# Altium project B100AA Development Kit.PrjPcb (part 5 of 5)

## Sheet Sleep Timer.SchDoc: Sleep Timer
size A3; ApprovedBy: Mehmet Günce Akkoyun; CheckedBy: Mehmet Günce Akkoyun; Author: Mehmet Günce Akkoyun; CompanyName: Ovoo Electronics; DrawnBy: Mehmet Günce Akkoyun; Engineer: Mehmet Günce Akkoyun; Organization: Ovoo Electronics; Address1: Necip Fazýl Mah. Ortaýrmak Sok.; Address2: Birgül Apt. No: 19/6; Address3: Meram / Konya; Address4: Turkiye; DocumentNumber: AA001; Revision: B100AA Dev Kit
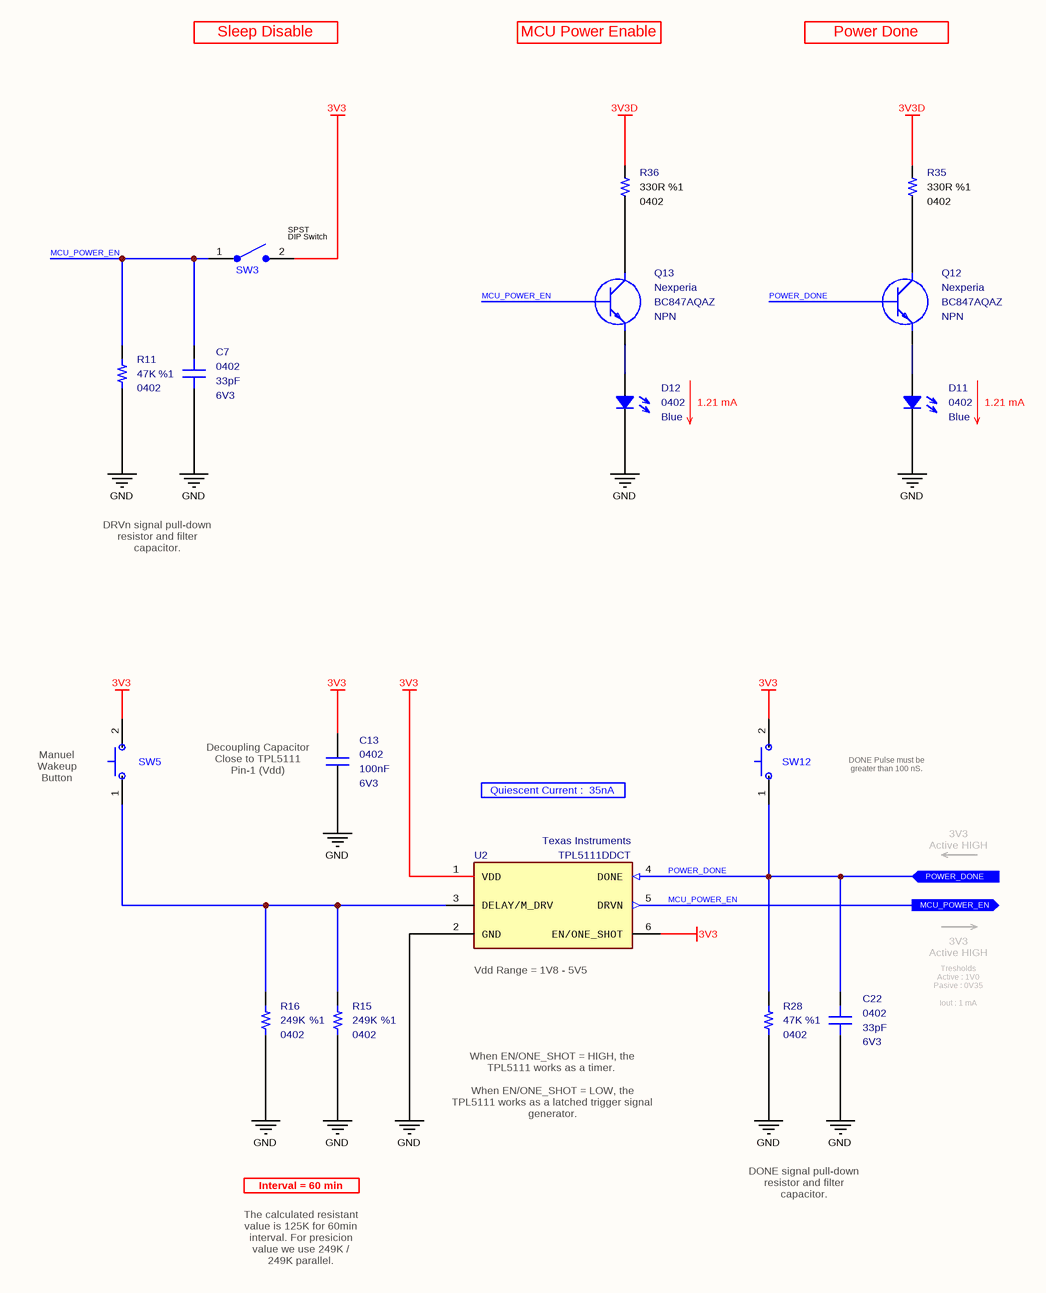
[diagram p36: Sleep Timer.SchDoc]

### Parts
C7  value 33pF  Case: 0402  Voltage: 6V3  [CAPACITOR_0402]  (hidden comment: Multilayer Ceramic Capacitor)
C13  value 100nF  Case: 0402  Voltage: 6V3  [CAPACITOR_0402]  (hidden comment: Multilayer Ceramic Capacitor)
C22  value 33pF  Case: 0402  Voltage: 6V3  [CAPACITOR_0402]  (hidden comment: Multilayer Ceramic Capacitor)
D11  Case: 0402  Color: Blue  [LED_0402]  (hidden comment: SMD LED (Blue))
D12  Case: 0402  Color: Blue  [LED_0402]  (hidden comment: SMD LED (Blue))
Q12  Manufacturer_Name: Nexperia  Manufacturer_Part_Number: BC847AQAZ  Polarity: NPN  [SOT1215]  (hidden comment: Bipolar NPN Transistors)
Q13  Manufacturer_Name: Nexperia  Manufacturer_Part_Number: BC847AQAZ  Polarity: NPN  [SOT1215]  (hidden comment: Bipolar NPN Transistors)
R11  value 47K  Tolerance: %1  Case: 0402  [RESISTOR_0402]  (hidden comment: Thick Film Resistor)
R15  value 249K  Tolerance: %1  Case: 0402  [RESISTOR_0402]  (hidden comment: Thick Film Resistor)
R16  value 249K  Tolerance: %1  Case: 0402  [RESISTOR_0402]  (hidden comment: Thick Film Resistor)
R28  value 47K  Tolerance: %1  Case: 0402  [RESISTOR_0402]  (hidden comment: Thick Film Resistor)
R35  value 330R  Tolerance: %1  Case: 0402  [RESISTOR_0402]  (hidden comment: Thick Film Resistor)
R36  value 330R  Tolerance: %1  Case: 0402  [RESISTOR_0402]  (hidden comment: Thick Film Resistor)
SW3  DIP Switch  [DS04-254-2-01BK-SMT-TR]  (value not drawn)
SW5  Tactile Switches  [PTS526_Switch]  (value not drawn)
SW12  Tactile Switches  [PTS526_Switch]  (value not drawn)
U2  Manufacturer _Part_Number: TPL5111DDCT  Manufacturer_Name: Texas Instruments  [SOT-23-6]  (hidden comment: Nanopower Timer IC)

### Ports
MCU_POWER_EN (out), POWER_DONE (in)

### Nets
3V3: C13.2 SW3.2(NO) SW5.2(COM) SW12.2(COM) U2.1(VDD) U2.6(EN/ONE_SHOT)
3V3D: R35.2 R36.2
GND: C7.1 C13.1 C22.1 D11.1 D12.1 R11.1 R15.1 R16.1 R28.1 U2.2(GND)
MCU_POWER_EN: C7.2 Q13.1(B) R11.2 SW3.1(COM) U2.5(DRVN) ; port MCU_POWER_EN
POWER_DONE: C22.2 Q12.1(B) R28.2 SW12.1(NC) U2.4(DONE) ; port POWER_DONE
NetD11_2: D11.2 Q12.2(E)
NetD12_2: D12.2 Q13.2(E)
NetQ12_3: Q12.3(C) R35.1
NetQ13_3: Q13.3(C) R36.1
NetR15_2: R15.2 R16.2 SW5.1(NC) U2.3(DELAY/M_DRV)

### Notes on the sheet
- Sleep Disable
- MCU Power Enable
- Power Done
- 1.21 mA
- DRVn signal pull-down resistor and filter capacitor.
- (near SW5) Manuel Wakeup Button
- (near C13) Decoupling Capacitor
  Close to TPL5111
  Pin-1 (Vdd)
- DONE Pulse must be greater than 100 nS.
- Quiescent Current :  35nA
- 3V3
  Active HIGH
- (near U2) Vdd Range = 1V8 - 5V5
- Tresholds
  Active : 1V0
  Pasive : 0V35
  Iout : 1 mA
- When EN/ONE_SHOT = HIGH, the TPL5111 works as a timer.
  When EN/ONE_SHOT = LOW, the TPL5111 works as a latched trigger signal generator.
- Interval = 60 min
- DONE signal pull-down resistor and filter capacitor.
- The calculated resistant value is 125K for 60min interval. For presicion value we use 249K / 249K parallel.
- Title
- Size:
- Date:
- A3
- Number:
- Time:
- Revision:
- Sheet
- of
- File:
- (in symbol Switch - DIP Switch (1 Pole)) SPST

### Library data of the parts
C7 C22 = Capacitor - 33pF [0402-6V3]: Capacitor - 33pF [0402] (Ceramic); Manufacturer_Name: Kemet; Manufacturer_Part_Number: C0402C330J9RACAUTO; Dielectric: X7R; Tolerance: 10%; Height: 0.5mm; Mouser_Part_Number: 80-C0402C330J9RAUTO; Maximum Operating Temperature: +125; Minimum Operating Temperature: -55; ROHS: Yes; ComponentLink1Description: DataSheet; ComponentLink1URL: https://api.kemet.com/component-edge/download/datasheet/C0402C330J9RACAUTO.pdf; ComponentLink2Description: Mouser; ComponentLink2URL: https://www.mouser.com/Search/Refine.aspx?Keyword=80-C0402C330J9RAUTO; Supplier 1: Mouser; Supplier Part Number 1: 80-C0402C330J9RAUTO
C13 = Capacitor - 100nF [0402-6V3]: Capacitor - 100nF [0402-6V3] (Ceramic); Manufacturer_Name: AVX; Manufacturer_Part_Number: 04026D104KAT4A; Dielectric: X5R; Tolerance: %10; Height: 0.25mm; Mouser_Part_Number: 581-04026D104KAT4A; ComponentLink1Description: Mouser; ComponentLink1URL: https://www.mouser.com.tr/ProductDetail/AVX/04026D104KAT4A?qs=sGAEpiMZZMs0AnBnWHyRQPg4iYkCw7IMED%2F4kpqgf7w%3D; ComponentLink2Description: DataSheet; ComponentLink2URL: https://www.mouser.com.tr/datasheet/2/40/cx5r-776519.pdf; ROHS: Yes; Maximum Operating Temperature: +85; Minimum Operating Temperature: -55; Supplier 1: Avnet; Supplier Part Number 1: 04026D104KAT4A
D11 D12 = Diode - LED (0402-Blue): as D53-D55 on sheet GSM Control Signals; Mouser_Part_Number: 755-SMLP13BC8TT86; ROHS: Yes; ComponentLink1Description: DataSheet; ComponentLink1URL: https://d1d2qsbl8m0m72.cloudfront.net/en/products/databook/datasheet/opto/led/chip_mono/sml-p1-e.pdf; ComponentLink2Description: Mouser; ComponentLink2URL: https://www.mouser.com.tr/ProductDetail/ROHM-Semiconductor/SMLP13BC8TT86?qs=%2Fha2pyFaduidYDgXFKL%252BNZwCVZNUI4FlyPWWbVDx1b6ABmzS%252BS2f0w%3D%3D; Supplier 1: Mouser; Supplier 2: Digi-Key; Supplier Part Number 1: 755-SMLP13BC8TT86; Supplier Part Number 2: 846-1112-1-ND
Q12 Q13 = Transistor - BC847: as Q50-Q52 on sheet GSM Control Signals; Mouser_Part_Number: 771-BC847AQAZ; ComponentLink1Description: DataSheet; ComponentLink1URL: https://www.mouser.com.tr/datasheet/2/916/BC847XQA_SER-1598405.pdf; ComponentLink2Description: Mouser; ComponentLink2URL: https://www.mouser.com.tr/ProductDetail/Nexperia/BC847AQAZ?qs=%2Fha2pyFaduhKMCPKNtQimeJpXTw9z4AqURd2YARs8DVICZNv3AT9Dw%3D%3D; Case: DFN-1010D-3; Supplier 1: Mouser; Supplier 2: Digi-Key; Supplier Part Number 1: 771-BC847AQAZ; Supplier Part Number 2: 1727-2545-1-ND
R11 R28 = Resistor - 47K: Thick Film Resistors - SMD 1/16 W 47 Kohms 1%; Manufacturer_Name: Vishay; Manufacturer_Part_Number: CRCW040247K0FKED; Height: 0.4mm; Mouser_Part_Number: 71-CRCW0402-47K-E3; ComponentLink1Description: DataSheet; ComponentLink1URL: https://www.mouser.com.tr/datasheet/2/427/dcrcwe3-1762152.pdf; ComponentLink2Description: Mouser; ComponentLink2URL: https://www.mouser.com.tr/ProductDetail/Vishay-Dale/CRCW040247K0FKED?qs=sGAEpiMZZMu61qfTUdNhG2DpbjADlD3GL%252B3h1elTxqU%3D; Supplier 1: Mouser; Supplier 2: Digi-Key; Supplier Part Number 1: 71-CRCW040247K0FKEDH; Supplier Part Number 2: 541-47.0KYCT-ND
R15 R16 = Resistor - 249K: Thick Film Resistors - SMD 1/16 W 249 Kohms 1%; Manufacturer_Name: Vishay; Manufacturer_Part_Number: CRCW0402249KFKED; Height: 0.35mm; Mouser_Part_Number: 71-CRCW0402-249K-E3; ComponentLink1Description: DataSheet; ComponentLink1URL: https://www.mouser.com.tr/datasheet/2/427/dcrcwe3-1762152.pdf; ComponentLink2Description: Mouser; ComponentLink2URL: https://www.mouser.com.tr/ProductDetail/Vishay-Dale/CRCW0402249KFKED?qs=sGAEpiMZZMu61qfTUdNhG2DpbjADlD3GEiYBObatoAI%3D; Supplier 1: Mouser; Supplier 2: Digi-Key; Supplier Part Number 1: 71-CRCW0402-249K-E3; Supplier Part Number 2: 541-249KLCT-ND
R35 R36 = Resistor - 330R: as R120-R122 on sheet GSM Control Signals; Height: 0.4mm; ComponentLink1Description: DataSheet; ComponentLink1URL: https://www.mouser.com.tr/datasheet/2/427/dcrcwe3-1762152.pdf; ComponentLink2Description: Mouser; ComponentLink2URL: https://www.mouser.com.tr/ProductDetail/Vishay-Dale/CRCW0402330RFKED?qs=sGAEpiMZZMu61qfTUdNhG2DpbjADlD3GGS6SwBlLi5Q%3D; Supplier 1: Mouser; Supplier 2: Digi-Key; Supplier Part Number 2: 541-330LCT-ND; Supplier Part Number 1: 71-CRCW0402-330-E3; Mouser Part Number: 71-CRCW0402-330-E3
SW3 = Switch - DIP Switch (1 Pole): DIP Switches/SIP Switches DIP Switch, SPST, 2.54 pitch, flat actuator, SMT, Tape and reel, 1 position, Black; Manufacturer Name: CUI Devices; Manufacturer Part Number: DS04-254-2-01BK-SMT-TR; Mouser Part Number: 490-DS04254201BK-STR; ComponentLink1Description: DataSheet; ComponentLink1URL: https://www.mouser.com.tr/datasheet/2/670/ds04_254_smt-1777718.pdf; ComponentLink2Description: Mouser; ComponentLink2URL: https://www.mouser.com.tr/ProductDetail/CUI-Devices/DS04-254-2-01BK-SMT-TR/?qs=%2Fha2pyFadujy0kBXqTx%252B7K4ZqypoI1xcyUu3ptD5LL%252BAwZdjUHFG%252BXP1ryAUxmHU; Supplier 1: RSComponents; Supplier 2: Arrow Electronics; Supplier 3: Farnell; Supplier 4: Newark; Supplier 5: Digi-Key; Supplier Part Number 1: 6820986; Supplier Part Number 2: A6S-1104-H; Supplier Part Number 3: 1960892; Supplier Part Number 4: 83T2298; Supplier Part Number 5: Z5187-ND
SW5 SW12 = Switch - Tactile: Tactile Switches 50mA 12VDC, 5.2x5.2mm, 0.8mm H, 260gf, G leads.; Manufacturer Name: C&K Switches; Manufacturer Part Number: PTS526 SK08 SMTR2 LFS; Height: 0.8mm; Mouser Part Number: 611-PTS526SK08SMTR2L; ComponentLink1Description: DataSheet; ComponentLink1URL: https://eu.mouser.com/datasheet/2/60/pts526-1651200.pdf; ComponentLink2Description: Mouser; ComponentLink2URL: https://eu.mouser.com/ProductDetail/CK/PTS526-SK08-SMTR2-LFS?qs=sGAEpiMZZMsgGjVA3toVBL%2FRce%252ByN3s1hQPqiLlQ%252BeM%3D; Supplier 1: Future Electronics; Supplier 2: Mouser; Supplier 3: Arrow; Supplier 4: Digi-Key; Supplier Part Number 1: PTS526SK08SMTR2LFS-REEL; Supplier Part Number 2: 611-PTS526SK08SMTR2L; Supplier Part Number 3: PTS526 SK08 SMTR2 LFS; Supplier Part Number 4: CKN12219-1-ND
U2 = IC - TPL5111: Timers & Support Products Ultra Low Power System Timer (35 nA) for Power Gating in duty cycled applications.; Supply Voltage - Min: 1.8V; Supply Voltage - Max: 5.5V; Height: 1.1mm; ROHS: Yes; Minimum Operating Temperature: -40; Maximum Operating Temperature: +105; ComponentLink1Description: DataSheet; ComponentLink1URL: http://www.ti.com/general/docs/suppproductinfo.tsp?distId=26&gotoUrl=http%3A%2F%2Fwww.ti.com%2Flit%2Fgpn%2Ftpl5111; Mouser_Part_Number: 595-TPL5111DDCT; ComponentLink2Description: Mouser; ComponentLink2URL: https://www.mouser.com/Search/Refine.aspx?Keyword=595-TPL5111DDCT; Supplier 1: Mouser; Supplier 2: Arrow; Supplier 3: Farnell; Supplier 4: Digi-Key; Supplier 5: Newark; Supplier Part Number 1: 595-TPL5111DDCT; Supplier Part Number 2: TPL5111DDCT; Supplier Part Number 3: 3006922; Supplier Part Number 4: 296-42621-1-ND; Supplier Part Number 5: 28AH5709

## Sheet 5V Enable.SchDoc: 5V Enable Switch
size A4; ApprovedBy: Mehmet Günce Akkoyun; CheckedBy: Mehmet Günce Akkoyun; Author: Mehmet Günce Akkoyun; CompanyName: Ovoo Electronics; DrawnBy: Mehmet Günce Akkoyun; Engineer: Mehmet Günce Akkoyun; Organization: Ovoo Electronics; Address1: Necip Fazýl Mah. Ortaýrmak Sok.; Address2: Birgül Apt. No: 19/6; Address3: Meram / Konya; Address4: Turkiye; DocumentNumber: AA001; Revision: B100AA Dev Kit
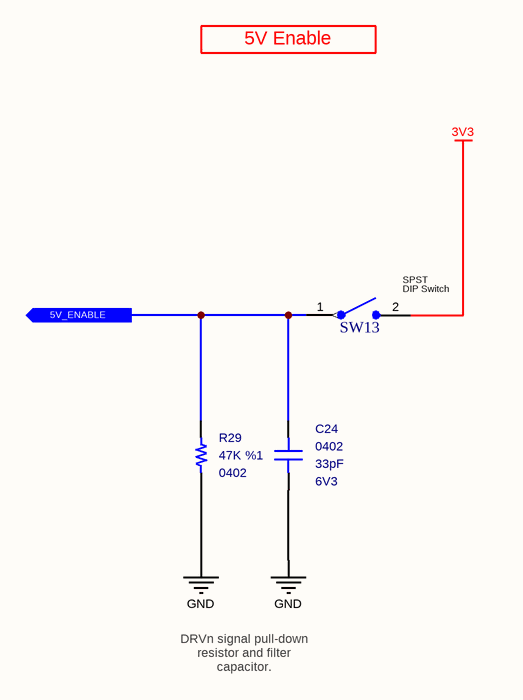
[diagram p37: 5V Enable.SchDoc]

### Parts
C24  value 33pF  Case: 0402  Voltage: 6V3  [CAPACITOR_0402]  (hidden comment: Multilayer Ceramic Capacitor)
R29  value 47K  Tolerance: %1  Case: 0402  [RESISTOR_0402]  (hidden comment: Thick Film Resistor)
SW13  DIP Switch  [DS04-254-2-01BK-SMT-TR]  (value not drawn)

### Ports
5V_ENABLE (out)

### Nets
3V3: SW13.2(NO)
GND: C24.1 R29.1
NetC24_2: C24.2 R29.2 SW13.1(COM) ; port 5V_ENABLE

### Notes on the sheet
- 5V Enable
- DRVn signal pull-down resistor and filter capacitor.
- Title
- Size:
- Date:
- A4
- Number:
- Time:
- Revision:
- Sheet
- of
- File:
- (in symbol Switch - DIP Switch (1 Pole)) SPST

### Library data of the parts
C24 = Capacitor - 33pF [0402-6V3]: as C7 on sheet Sleep Timer; Height: 0.5mm; Mouser_Part_Number: 80-C0402C330J9RAUTO; Maximum Operating Temperature: +125; Minimum Operating Temperature: -55; ROHS: Yes; ComponentLink1Description: DataSheet; ComponentLink1URL: https://api.kemet.com/component-edge/download/datasheet/C0402C330J9RACAUTO.pdf; ComponentLink2Description: Mouser; ComponentLink2URL: https://www.mouser.com/Search/Refine.aspx?Keyword=80-C0402C330J9RAUTO; Supplier 1: Mouser; Supplier Part Number 1: 80-C0402C330J9RAUTO
R29 = Resistor - 47K: as R11 on sheet Sleep Timer; Height: 0.4mm; Mouser_Part_Number: 71-CRCW0402-47K-E3; ComponentLink1Description: DataSheet; ComponentLink1URL: https://www.mouser.com.tr/datasheet/2/427/dcrcwe3-1762152.pdf; ComponentLink2Description: Mouser; ComponentLink2URL: https://www.mouser.com.tr/ProductDetail/Vishay-Dale/CRCW040247K0FKED?qs=sGAEpiMZZMu61qfTUdNhG2DpbjADlD3GL%252B3h1elTxqU%3D; Supplier 1: Mouser; Supplier 2: Digi-Key; Supplier Part Number 1: 71-CRCW040247K0FKEDH; Supplier Part Number 2: 541-47.0KYCT-ND
SW13 = Switch - DIP Switch (1 Pole): as SW3 on sheet Sleep Timer; Manufacturer Part Number: DS04-254-2-01BK-SMT-TR; Mouser Part Number: 490-DS04254201BK-STR; ComponentLink1Description: DataSheet; ComponentLink1URL: https://www.mouser.com.tr/datasheet/2/670/ds04_254_smt-1777718.pdf; ComponentLink2Description: Mouser; ComponentLink2URL: https://www.mouser.com.tr/ProductDetail/CUI-Devices/DS04-254-2-01BK-SMT-TR/?qs=%2Fha2pyFadujy0kBXqTx%252B7K4ZqypoI1xcyUu3ptD5LL%252BAwZdjUHFG%252BXP1ryAUxmHU; Supplier 1: RSComponents; Supplier 2: Arrow Electronics; Supplier 3: Farnell; Supplier 4: Newark; Supplier 5: Digi-Key; Supplier Part Number 1: 6820986; Supplier Part Number 2: A6S-1104-H; Supplier Part Number 3: 1960892; Supplier Part Number 4: 83T2298; Supplier Part Number 5: Z5187-ND

## Sheet Power Switch.SchDoc: Main Power Switch
size A4; ApprovedBy: Mehmet Günce Akkoyun; CheckedBy: Mehmet Günce Akkoyun; Author: Mehmet Günce Akkoyun; CompanyName: Ovoo Electronics; DrawnBy: Mehmet Günce Akkoyun; Engineer: Mehmet Günce Akkoyun; Organization: Ovoo Electronics; Address1: Necip Fazýl Mah. Ortaýrmak Sok.; Address2: Birgül Apt. No: 19/6; Address3: Meram / Konya; Address4: Turkiye; DocumentNumber: AA001; Revision: B100AA Dev Kit
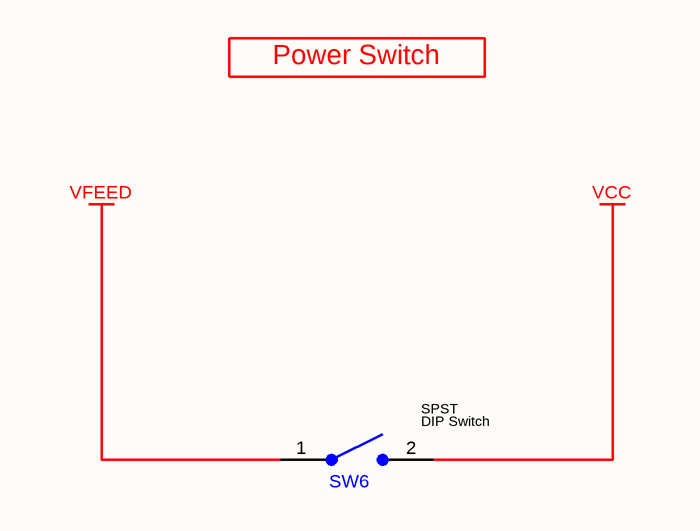
[diagram p38: Power Switch.SchDoc]

### Parts
SW6  DIP Switch  [DS04-254-2-01BK-SMT-TR]  (value not drawn)

### Nets
VCC: SW6.2(NO)
VFEED: SW6.1(COM)

### Notes on the sheet
- Power Switch
- Title
- Size:
- Date:
- A4
- Number:
- Time:
- Revision:
- Sheet
- of
- File:
- (in symbol Switch - DIP Switch (1 Pole)) SPST

### Library data of the parts
SW6 = Switch - DIP Switch (1 Pole): as SW3 on sheet Sleep Timer; Manufacturer Part Number: DS04-254-2-01BK-SMT-TR; Mouser Part Number: 490-DS04254201BK-STR; ComponentLink1Description: DataSheet; ComponentLink1URL: https://www.mouser.com.tr/datasheet/2/670/ds04_254_smt-1777718.pdf; ComponentLink2Description: Mouser; ComponentLink2URL: https://www.mouser.com.tr/ProductDetail/CUI-Devices/DS04-254-2-01BK-SMT-TR/?qs=%2Fha2pyFadujy0kBXqTx%252B7K4ZqypoI1xcyUu3ptD5LL%252BAwZdjUHFG%252BXP1ryAUxmHU; Supplier 1: RSComponents; Supplier 2: Arrow Electronics; Supplier 3: Farnell; Supplier 4: Newark; Supplier 5: Digi-Key; Supplier Part Number 1: 6820986; Supplier Part Number 2: A6S-1104-H; Supplier Part Number 3: 1960892; Supplier Part Number 4: 83T2298; Supplier Part Number 5: Z5187-ND

## Sheet FOTA MCU ICSP Communication.SchDoc: FOTA MCU ICSP Communication Socket
size A4; ApprovedBy: Mehmet Günce Akkoyun; CheckedBy: Mehmet Günce Akkoyun; Author: Mehmet Günce Akkoyun; CompanyName: Ovoo Electronics; DrawnBy: Mehmet Günce Akkoyun; Engineer: Mehmet Günce Akkoyun; Organization: Ovoo Electronics; Address1: Necip Fazýl Mah. Ortaýrmak Sok.; Address2: Birgül Apt. No: 19/6; Address3: Meram / Konya; Address4: Turkiye; DocumentNumber: AA001; Revision: B100AA Dev Kit
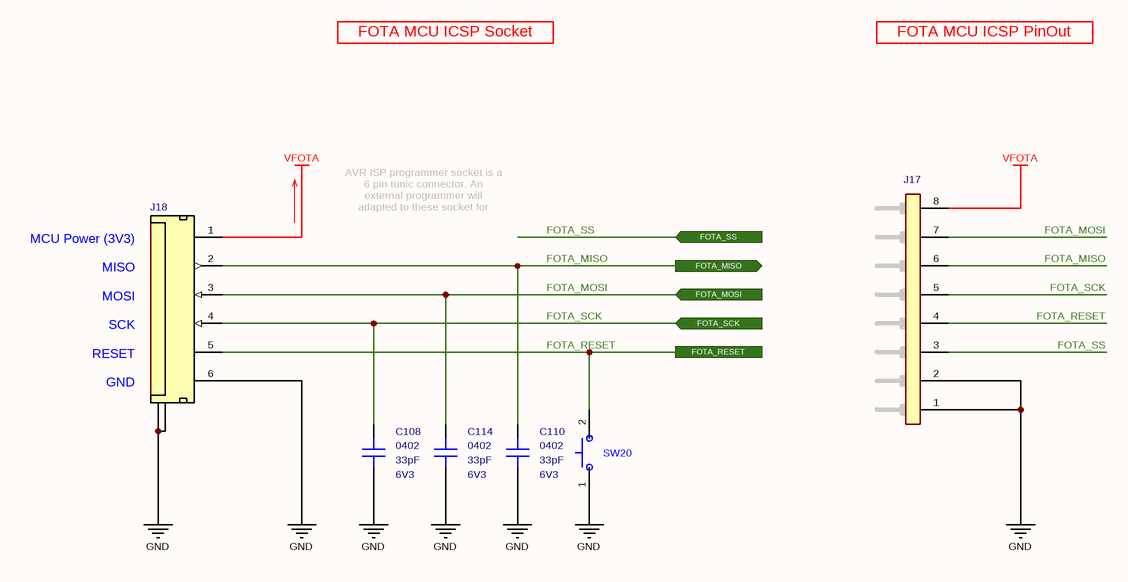
[diagram p39: FOTA MCU ICSP Communication.SchDoc]

### Parts
C108  value 33pF  Case: 0402  Voltage: 6V3  [CAPACITOR_0402]  (hidden comment: Multilayer Ceramic Capacitor)
C110  value 33pF  Case: 0402  Voltage: 6V3  [CAPACITOR_0402]  (hidden comment: Multilayer Ceramic Capacitor)
C114  value 33pF  Case: 0402  Voltage: 6V3  [CAPACITOR_0402]  (hidden comment: Multilayer Ceramic Capacitor)
J17  2.54 mm Pitch 8P Male Connector  [8P Header]  (value not drawn)
J18  6P Tunic Connector  [Connector_Tunic 6P - H]  (value not drawn)
SW20  Tactile Switches  [PTS526_Switch]  (value not drawn)

### Ports
FOTA_MISO (out), FOTA_MOSI (in), FOTA_RESET, FOTA_SCK (in), FOTA_SS (in)

### Nets
GND: C108.2 C110.2 C114.2 J17.1(Pin-1) J17.2(Pin-2) J18.6(M_DRV) J18.7(GND) J18.8(GND) SW20.1(NC)
VFOTA: J17.8(Pin-8) J18.1(VBAT)
FOTA_MISO: C110.1 J17.6(Pin-6) J18.2(M_DRV) ; port FOTA_MISO
FOTA_MOSI: C114.1 J17.7(Pin-7) J18.3(M_DRV) ; port FOTA_MOSI
FOTA_RESET: J17.4(Pin-4) J18.5(M_DRV) SW20.2(COM) ; port FOTA_RESET
FOTA_SCK: C108.1 J17.5(Pin-5) J18.4(M_DRV) ; port FOTA_SCK
FOTA_SS: J17.3(Pin-3) ; port FOTA_SS

### Notes on the sheet
- FOTA MCU ICSP Socket
- FOTA MCU ICSP PinOut
- AVR ISP programmer socket is a 6 pin tunic connector. An external programmer will adapted to these socket for programming MCU.
- (near J18) MCU Power (3V3)
  MISO
  MOSI
  SCK
  RESET
  GND
- Title
- Size:
- Date:
- A4
- Number:
- Time:
- Revision:
- Sheet
- of
- File:

### Library data of the parts
C108 C110 C114 = Capacitor - 33pF [0402-6V3]: as C7 on sheet Sleep Timer; Height: 0.5mm; Mouser_Part_Number: 80-C0402C330J9RAUTO; Maximum Operating Temperature: +125; Minimum Operating Temperature: -55; ROHS: Yes; ComponentLink1Description: DataSheet; ComponentLink1URL: https://api.kemet.com/component-edge/download/datasheet/C0402C330J9RACAUTO.pdf; ComponentLink2Description: Mouser; ComponentLink2URL: https://www.mouser.com/Search/Refine.aspx?Keyword=80-C0402C330J9RAUTO; Supplier 1: Mouser; Supplier Part Number 1: 80-C0402C330J9RAUTO
J17 = Connector - Male Header 8P (2.54): Headers & Wire Housings BREAKAWAY HDR VERT 8; Manufacturer Name: Molex; Position: 8; Row: 1; Pitch: 2.54 mm; Manufacturer Part Number: 22-28-4083; Mouser Part Number: 538-22-28-4083; ROHS: Yes; ComponentLink1Description: DataSheet; ComponentLink1URL: https://www.mouser.com.tr/datasheet/2/276/0022284063_PCB_HEADERS-228265.pdf; ComponentLink2Description: Mouser; ComponentLink2URL: https://www.mouser.com.tr/ProductDetail/Molex/22-28-4083/?qs=%2Fha2pyFaduguMWEp6M%252Bj0x6fHxUvnRGD%252BIxBoa6MO5w%3D
J18 = Connector - Mini Tunic 6P (1.25): Mini Tunic Connector with 6P; Manufacturer_Name: Molex; Manufacturer_Part_Number: 53261-0671; ROHS: Yes; Supplier 1: Avnet; Supplier 2: Mouser; Supplier 3: Arrow; Supplier 4: Farnell; Supplier 5: Newark; Supplier 6: Digi-Key; Supplier Part Number 1: 0532610671; Supplier Part Number 2: 538-53261-0671; Supplier Part Number 3: 53261-0671; Supplier Part Number 4: 1125375; Supplier Part Number 5: 93K4246; Supplier Part Number 6: WM7624CT-ND; System: Connector
SW20 = Switch - Tactile: as SW5 on sheet Sleep Timer; Height: 0.8mm; Mouser Part Number: 611-PTS526SK08SMTR2L; ComponentLink1Description: DataSheet; ComponentLink1URL: https://eu.mouser.com/datasheet/2/60/pts526-1651200.pdf; ComponentLink2Description: Mouser; ComponentLink2URL: https://eu.mouser.com/ProductDetail/CK/PTS526-SK08-SMTR2-LFS?qs=sGAEpiMZZMsgGjVA3toVBL%2FRce%252ByN3s1hQPqiLlQ%252BeM%3D; Supplier 1: Future Electronics; Supplier 2: Mouser; Supplier 3: Arrow; Supplier 4: Digi-Key; Supplier Part Number 1: PTS526SK08SMTR2LFS-REEL; Supplier Part Number 2: 611-PTS526SK08SMTR2L; Supplier Part Number 3: PTS526 SK08 SMTR2 LFS; Supplier Part Number 4: CKN12219-1-ND

## Sheet I2C PinOut.SchDoc: Master I2C PinOut
size A4; ApprovedBy: Mehmet Günce Akkoyun; CheckedBy: Mehmet Günce Akkoyun; Author: Mehmet Günce Akkoyun; CompanyName: Ovoo Electronics; DrawnBy: Mehmet Günce Akkoyun; Engineer: Mehmet Günce Akkoyun; Organization: Ovoo Electronics; Address1: Necip Fazýl Mah. Ortaýrmak Sok.; Address2: Birgül Apt. No: 19/6; Address3: Meram / Konya; Address4: Turkiye; DocumentNumber: AA001; Revision: B100AA Dev Kit
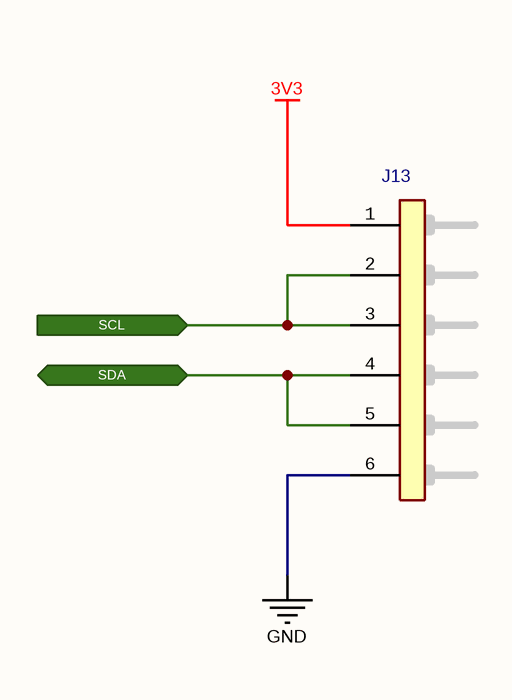
[diagram p40: I2C PinOut.SchDoc]

### Parts
J13  2.54 mm Pitch 6P Male Connector  [6P Header]  (value not drawn)

### Ports
SCL (in), SDA (bidir)

### Nets
3V3: J13.1(Pin-1)
GND: J13.6(Pin-6)
NetJ7_45: J13.2(Pin-2) J13.3(Pin-3) ; port SCL
NetJ7_46: J13.4(Pin-4) J13.5(Pin-5) ; port SDA

### Notes on the sheet
- Title
- Size:
- Date:
- A4
- Number:
- Time:
- Revision:
- Sheet
- of
- File:

### Library data of the parts
J13 = Connector - Male Header 6P (2.54): Headers & Wire Housings BREAKAWAY HDR VERT 6; Manufacturer Name: Molex; Position: 6; Row: 1; Pitch: 2.54 mm; Manufacturer Part Number: 22-28-4063; Mouser Part Number: 538-22-28-4063; ROHS: Yes; ComponentLink1Description: DataSheet; ComponentLink1URL: https://www.mouser.com.tr/datasheet/2/276/0022284063_PCB_HEADERS-228265.pdf; ComponentLink2Description: Mouser; ComponentLink2URL: https://www.mouser.com.tr/ProductDetail/Molex/22-28-4063?qs=sGAEpiMZZMs%252BGHln7q6pm%252BS0pk2Wo0XxVjxVgqsrZJ8%3D; Supplier 1: Mouser; Supplier 2: Digi-Key; Supplier Part Number 2: WM50016-06-ND; Supplier Part Number 1: 538-22-28-4063

## Nets that join several sheets
3V3: Connection Socket (J7.29 J7.32 J12.29 J12.32), GSM Control Signals (5 pins), Digital ICSP Test Points (J20.1), Power LED Inducators (C28.1 Q14.1), Power Test Pins (J3.4), Sleep Timer (6 pins), 5V Enable (SW13.2), I2C PinOut (J13.1)
3V3D: Digital Port A Default State DIP (SW2.9), Digital Port A State LED Inducator (8 pins), Digital Port A Button (SW10.9), Digital Port C Default State DIP (SW17.9), Digital Port C State LED Inducator (8 pins), Digital Port C Button (SW24.9), Digital Port F Default State DIP (SW29.9), Digital Port F State LED Inducator (8 pins), Digital Port F Button (SW34.9), Digital Port K Default State DIP (SW39.9), Digital Port K State LED Inducator (8 pins), Digital Port K Button (SW44.9), Digital Port L Default State DIP (SW52.9), Digital Port L State LED Inducator (8 pins), Digital Port L Button (SW59.9), GSM Communication Signals (6 pins), GSM Control Signals (6 pins), ADS Sensor Sockets (J5.2 J6.2), Signal Outputs (5 pins), Power LED Inducators (7 pins), 3V3 LDO Regulator (5 pins), Power Test Pins (J3.7), Sleep Timer (R35.2 R36.2)
3V8: Connection Socket (J7.28 J7.33 J12.28 J12.33), Power LED Inducators (C23.1 Q9.1), Power Test Pins (J3.2)
5V: Connection Socket (J7.34 J12.3), ADS Sensor Sockets (J5.1 J6.1), Power LED Inducators (C27.1 Q10.1), Power Test Pins (J3.3)
GND: Connection Socket (8 pins), Digital Port A Default State DIP (SW2.10), Digital Port A State LED Inducator (16 pins), Digital Port A Button (9 pins), Digital Port C Default State DIP (SW17.10), Digital Port C State LED Inducator (16 pins), Digital Port C Button (9 pins), Digital Port F Default State DIP (SW29.10), Digital Port F State LED Inducator (16 pins), Digital Port F Button (9 pins), Digital Port K Default State DIP (SW39.10), Digital Port K State LED Inducator (16 pins), Digital Port K Button (9 pins), Digital Port L Default State DIP (SW52.10), Digital Port L State LED Inducator (16 pins), Digital Port L Button (9 pins), External SIM Tray (6 pins), GSM Communication Signals (12 pins), GSM Control Signals (12 pins), ADS Sensor Sockets (12 pins), Digital ICSP Test Points (J20.6), Master MCU ICSP Communication (9 pins), UART Communication (36 pins), Signal Outputs (12 pins), Power LED Inducators (14 pins), 3V3 LDO Regulator (5 pins), Power Test Pins (J3.8), External Power Feed (J1.2), Sleep Timer (10 pins), 5V Enable (C24.1 R29.1), FOTA MCU ICSP Communication (9 pins), I2C PinOut (J13.6)
VCC: Connection Socket (J7.1 J7.60 J12.1 J12.60), Power LED Inducators (C21.1 Q8.1), Power Test Pins (J3.1), Power Switch (SW6.2)
VFEED: Power LED Inducators (R8.2), 3V3 LDO Regulator (C14.1 U1.3), External Power Feed (J1.1), Power Switch (SW6.1)
VFOTA: Connection Socket (J7.3), Power LED Inducators (C30.1 Q16.1), Power Test Pins (J3.6), FOTA MCU ICSP Communication (J17.8 J18.1)
VMCU: Connection Socket (J7.2 J7.59 J12.2 J12.59), Master MCU ICSP Communication (J15.8 J16.1), Power LED Inducators (C29.1 Q15.1), Power Test Pins (J3.5)
BURN_EN: Connection Socket (J12.47), Signal Outputs (C65.1 J8.1 Q33.1)
FOTA_MISO: Connection Socket (J12.14), FOTA MCU ICSP Communication (C110.1 J17.6 J18.2)
FOTA_MOSI: Connection Socket (J12.13), FOTA MCU ICSP Communication (C114.1 J17.7 J18.3)
FOTA_PWR_DONE: Connection Socket (J12.49), Signal Outputs (C61.1 J8.3 Q30.1)
FOTA_PWR_EN: Connection Socket (J12.48), Signal Outputs (C63.1 J8.2 Q32.1)
FOTA_RESET: Connection Socket (J12.16), FOTA MCU ICSP Communication (J17.4 J18.5 SW20.2)
FOTA_SCK: Connection Socket (J12.15), FOTA MCU ICSP Communication (C108.1 J17.5 J18.4)
FOTA_SS: Connection Socket (J12.17), FOTA MCU ICSP Communication (J17.3)
GSM_COMM_EN: Connection Socket (J12.23), GSM Control Signals (C94.1 Q51.1 SW47.1)
GSM_CTS: Connection Socket (J12.53), GSM Communication Signals (C75.1 J11.4 Q39.1)
GSM_DCD: Connection Socket (J12.52), GSM Communication Signals (C76.1 J11.3 Q40.1)
GSM_DSR: Connection Socket (J12.51), GSM Communication Signals (C79.1 J11.2 Q42.1)
GSM_DTR: Connection Socket (J12.55), GSM Communication Signals (C71.1 J11.6 Q36.1)
GSM_LED_EN: Connection Socket (J12.24), GSM Control Signals (C93.1 Q50.1 SW46.1)
GSM_PWR_EN: Connection Socket (J12.22), GSM Control Signals (C95.1 Q52.1 SW48.1)
GSM_RING: Connection Socket (J12.50), GSM Communication Signals (C80.1 J11.1 Q43.1)
GSM_RTS: Connection Socket (J12.54), GSM Communication Signals (C73.1 J11.5 Q37.1)
MASTER_MISO: Connection Socket (J7.16), Master MCU ICSP Communication (C99.1 J15.6 J16.2)
MASTER_MOSI: Connection Socket (J7.15), Master MCU ICSP Communication (C100.1 J15.7 J16.3)
MASTER_RESET: Connection Socket (J7.17), Master MCU ICSP Communication (J15.4 J16.5 SW19.2)
MASTER_SCK: Connection Socket (J7.14), Master MCU ICSP Communication (C97.1 J15.5 J16.4)
MASTER_SS: Connection Socket (J7.13), Master MCU ICSP Communication (J15.3)
MCU_POWER_EN: Connection Socket (J12.42), Sleep Timer (5 pins)
MUX_DIRECTION: Connection Socket (J7.49), Signal Outputs (C57.1 J8.4 Q29.1)
NetC24_2: Connection Socket (J7.26), 5V Enable (C24.2 R29.2 SW13.1)
NetC56_2: Connection Socket (J12.21), External SIM Tray (C56.2 C59.2 J9.1)
NetC62_2: Connection Socket (J12.19), External SIM Tray (C62.2 J9.2)
NetC64_2: Connection Socket (J12.18), External SIM Tray (C64.2 J9.3)
NetC70_2: Connection Socket (J12.20), External SIM Tray (C70.2 J9.7)
NetC111_1: Connection Socket (J12.27), GSM Control Signals (C111.1 Q57.1)
NetC112_1: Connection Socket (J12.26), GSM Control Signals (C112.1 Q58.1 SW55.1)
NetC113_1: Connection Socket (J12.25), GSM Control Signals (C113.1 Q59.1 SW56.1)
NetJ5_3: Connection Socket (J7.43), ADS Sensor Sockets (J5.3)
NetJ5_4: Connection Socket (J7.44), ADS Sensor Sockets (J5.4)
NetJ6_3: Connection Socket (J7.41), ADS Sensor Sockets (J6.3)
NetJ6_4: Connection Socket (J7.42), ADS Sensor Sockets (J6.4)
NetJ7_35: Connection Socket (J7.35), UART Communication (U6.10)
NetJ7_36: Connection Socket (J7.36), UART Communication (U6.7)
NetJ7_37: Connection Socket (J7.37), UART Communication (U5.10)
NetJ7_38: Connection Socket (J7.38), UART Communication (U5.7)
NetJ7_39: Connection Socket (J7.39), UART Communication (U4.10)
NetJ7_40: Connection Socket (J7.40), UART Communication (U4.7)
NetJ7_45: Connection Socket (J7.45), I2C PinOut (J13.2 J13.3)
NetJ7_46: Connection Socket (J7.46), I2C PinOut (J13.4 J13.5)
NetJ7_48: Connection Socket (J7.48), Signal Outputs (J8.6)
NetJ12_43: Connection Socket (J12.43), Digital ICSP Test Points (J20.2)
NetJ12_44: Connection Socket (J12.44), Digital ICSP Test Points (J20.3)
NetJ12_45: Connection Socket (J12.45), Digital ICSP Test Points (J20.4)
NetJ12_46: Connection Socket (J12.46), Digital ICSP Test Points (J20.5)
NetJ12_56: Connection Socket (J12.56), UART Communication (U3.10)
NetJ12_57: Connection Socket (J12.57), UART Communication (U3.7)
PA0: Connection Socket (J12.34), Digital Port A (J2.1), Digital Port A Default State DIP (R1.2), Digital Port A State LED Inducator (C2.1 Q1.1), Digital Port A Button (C1.2 SW1.1)
PA1: Connection Socket (J12.35), Digital Port A (J2.2), Digital Port A Default State DIP (R3.2), Digital Port A State LED Inducator (C4.1 Q2.1), Digital Port A Button (C3.2 SW4.1)
PA2: Connection Socket (J12.36), Digital Port A (J2.3), Digital Port A Default State DIP (R4.2), Digital Port A State LED Inducator (C6.1 Q3.1), Digital Port A Button (C5.2 SW7.1)
PA3: Connection Socket (J12.37), Digital Port A (J2.4), Digital Port A Default State DIP (R6.2), Digital Port A State LED Inducator (C9.1 Q4.1), Digital Port A Button (C8.2 SW8.1)
PA4: Connection Socket (J12.38), Digital Port A (J2.5), Digital Port A Default State DIP (R7.2), Digital Port A State LED Inducator (C16.1 Q5.1), Digital Port A Button (C15.2 SW9.1)
PA5: Connection Socket (J12.39), Digital Port A (J2.6), Digital Port A Default State DIP (R10.2), Digital Port A State LED Inducator (C18.1 Q6.1), Digital Port A Button (C17.2 SW11.1)
PA6: Connection Socket (J12.40), Digital Port A (J2.7), Digital Port A Default State DIP (R12.2), Digital Port A State LED Inducator (C20.1 Q7.1), Digital Port A Button (C19.2 SW14.1)
PA7: Connection Socket (J12.41), Digital Port A (J2.8), Digital Port A Default State DIP (R13.2), Digital Port A State LED Inducator (C26.1 Q11.1), Digital Port A Button (C25.2 SW15.1)
PC0: Connection Socket (J7.18), Digital Port C (J4.1), Digital Port C Default State DIP (R40.2), Digital Port C State LED Inducator (C41.1 Q21.1), Digital Port C Button (C31.2 SW16.1)
PC1: Connection Socket (J7.19), Digital Port C (J4.2), Digital Port C Default State DIP (R42.2), Digital Port C State LED Inducator (C43.1 Q22.1), Digital Port C Button (C33.2 SW18.1)
PC2: Connection Socket (J7.20), Digital Port C (J4.3), Digital Port C Default State DIP (R43.2), Digital Port C State LED Inducator (C45.1 Q23.1), Digital Port C Button (C35.2 SW21.1)
PC3: Connection Socket (J7.21), Digital Port C (J4.4), Digital Port C Default State DIP (R45.2), Digital Port C State LED Inducator (C48.1 Q24.1), Digital Port C Button (C38.2 SW22.1)
PC4: Connection Socket (J7.22), Digital Port C (J4.5), Digital Port C Default State DIP (R46.2), Digital Port C State LED Inducator (C32.1 Q17.1), Digital Port C Button (C40.2 SW23.1)
PC5: Connection Socket (J7.23), Digital Port C (J4.6), Digital Port C Default State DIP (R48.2), Digital Port C State LED Inducator (C34.1 Q18.1), Digital Port C Button (C42.2 SW25.1)
PC6: Connection Socket (J7.24), Digital Port C (J4.7), Digital Port C Default State DIP (R49.2), Digital Port C State LED Inducator (C36.1 Q19.1), Digital Port C Button (C44.2 SW26.1)
PC7: Connection Socket (J7.25), Digital Port C (J4.8), Digital Port C Default State DIP (R51.2), Digital Port C State LED Inducator (C39.1 Q20.1), Digital Port C Button (C47.2 SW27.1)
PF0: Connection Socket (J7.57), Digital Port F (J10.1), Digital Port F Default State DIP (R68.2), Digital Port F State LED Inducator (C67.1 Q34.1), Digital Port F Button (C49.2 SW28.1)
PF1: Connection Socket (J7.56), Digital Port F (J10.2), Digital Port F Default State DIP (R70.2), Digital Port F State LED Inducator (C69.1 Q35.1), Digital Port F Button (C51.2 SW30.1)
PF2: Connection Socket (J7.55), Digital Port F (J10.3), Digital Port F Default State DIP (R71.2), Digital Port F State LED Inducator (C74.1 Q38.1), Digital Port F Button (C53.2 SW31.1)
PF3: Connection Socket (J7.54), Digital Port F (J10.4), Digital Port F Default State DIP (R73.2), Digital Port F State LED Inducator (C78.1 Q41.1), Digital Port F Button (C58.2 SW32.1)
PF4: Connection Socket (J7.53), Digital Port F (J10.5), Digital Port F Default State DIP (R74.2), Digital Port F State LED Inducator (C50.1 Q25.1), Digital Port F Button (C66.2 SW33.1)
PF5: Connection Socket (J7.52), Digital Port F (J10.6), Digital Port F Default State DIP (R77.2), Digital Port F State LED Inducator (C52.1 Q26.1), Digital Port F Button (C68.2 SW35.1)
PF6: Connection Socket (J7.51), Digital Port F (J10.7), Digital Port F Default State DIP (R79.2), Digital Port F State LED Inducator (C54.1 Q27.1), Digital Port F Button (C72.2 SW36.1)
PF7: Connection Socket (J7.50), Digital Port F (J10.8), Digital Port F Default State DIP (R81.2), Digital Port F State LED Inducator (C60.1 Q31.1), Digital Port F Button (C77.2 SW37.1)
PK0: Connection Socket (J7.5), Digital Port K (J14.1), Digital Port K Default State DIP (R103.2), Digital Port K State LED Inducator (C90.1 Q48.1), Digital Port K Button (C81.2 SW38.1)
PK1: Connection Socket (J7.6), Digital Port K (J14.2), Digital Port K Default State DIP (R105.2), Digital Port K State LED Inducator (C92.1 Q49.1), Digital Port K Button (C83.2 SW40.1)
PK2: Connection Socket (J7.7), Digital Port K (J14.3), Digital Port K Default State DIP (R106.2), Digital Port K State LED Inducator (C98.1 Q53.1), Digital Port K Button (C85.2 SW41.1)
PK3: Connection Socket (J7.8), Digital Port K (J14.4), Digital Port K Default State DIP (R108.2), Digital Port K State LED Inducator (C102.1 Q54.1), Digital Port K Button (C87.2 SW42.1)
PK4: Connection Socket (J7.9), Digital Port K (J14.5), Digital Port K Default State DIP (R109.2), Digital Port K State LED Inducator (C82.1 Q44.1), Digital Port K Button (C89.2 SW43.1)
PK5: Connection Socket (J7.10), Digital Port K (J14.6), Digital Port K Default State DIP (R111.2), Digital Port K State LED Inducator (C84.1 Q45.1), Digital Port K Button (C91.2 SW45.1)
PK6: Connection Socket (J7.11), Digital Port K (J14.7), Digital Port K Default State DIP (R112.2), Digital Port K State LED Inducator (C86.1 Q46.1), Digital Port K Button (C96.2 SW49.1)
PK7: Connection Socket (J7.12), Digital Port K (J14.8), Digital Port K Default State DIP (R113.2), Digital Port K State LED Inducator (C88.1 Q47.1), Digital Port K Button (C101.2 SW50.1)
PL0: Connection Socket (J12.5), Digital Port L (J19.1), Digital Port L Default State DIP (R130.2), Digital Port L State LED Inducator (C118.1 Q62.1), Digital Port L Button (C103.2 SW51.1)
PL1: Connection Socket (J12.6), Digital Port L (J19.2), Digital Port L Default State DIP (R132.2), Digital Port L State LED Inducator (C120.1 Q63.1), Digital Port L Button (C105.2 SW53.1)
PL2: Connection Socket (J12.7), Digital Port L (J19.3), Digital Port L Default State DIP (R133.2), Digital Port L State LED Inducator (C130.1 Q64.1), Digital Port L Button (C107.2 SW54.1)
PL3: Connection Socket (J12.8), Digital Port L (J19.4), Digital Port L Default State DIP (R135.2), Digital Port L State LED Inducator (C148.1 Q65.1), Digital Port L Button (C115.2 SW57.1)
PL4: Connection Socket (J12.9), Digital Port L (J19.5), Digital Port L Default State DIP (R136.2), Digital Port L State LED Inducator (C104.1 Q55.1), Digital Port L Button (C117.2 SW58.1)
PL5: Connection Socket (J12.10), Digital Port L (J19.6), Digital Port L Default State DIP (R141.2), Digital Port L State LED Inducator (C106.1 Q56.1), Digital Port L Button (C119.2 SW60.1)
PL6: Connection Socket (J12.11), Digital Port L (J19.7), Digital Port L Default State DIP (R142.2), Digital Port L State LED Inducator (C109.1 Q60.1), Digital Port L Button (C129.2 SW61.1)
PL7: Connection Socket (J12.12), Digital Port L (J19.8), Digital Port L Default State DIP (R143.2), Digital Port L State LED Inducator (C116.1 Q61.1), Digital Port L Button (C147.2 SW62.1)
POWER_DONE: Connection Socket (J7.27), Sleep Timer (5 pins)
RTC_INTERUPT: Connection Socket (J7.47), Signal Outputs (C55.1 J8.5 Q28.1)